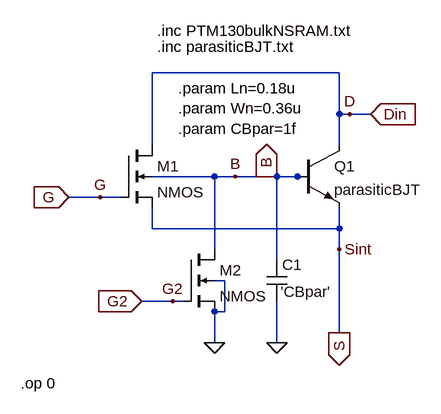
[diagram p0: schematic 2tnsram_simple.asc]
2tnsram_simple.asc, the LTspice schematic file:
Version 4
SHEET 1 3052 680
WIRE 800 0 512 0
WIRE 800 64 800 0
WIRE 816 64 800 64
WIRE 848 64 816 64
WIRE 512 112 512 0
WIRE 800 112 800 64
WIRE 608 160 512 160
WIRE 640 160 608 160
WIRE 688 160 640 160
WIRE 704 160 688 160
WIRE 736 160 704 160
WIRE 752 160 736 160
WIRE 432 192 384 192
WIRE 464 192 432 192
WIRE 512 240 512 208
WIRE 800 240 800 208
WIRE 800 240 512 240
WIRE 608 272 608 160
WIRE 800 272 800 240
WIRE 704 288 704 160
WIRE 624 320 608 320
WIRE 544 352 496 352
WIRE 560 352 544 352
WIRE 624 368 624 320
WIRE 624 368 608 368
WIRE 800 400 800 272
WIRE 608 416 608 368
WIRE 704 416 704 352
FLAG 640 160 B
FLAG 800 272 Sint
FLAG 816 64 D
FLAG 704 416 0
FLAG 608 416 0
FLAG 432 192 G
FLAG 544 352 G2
FLAG 384 192 G
IOPIN 384 192 In
FLAG 496 352 G2
IOPIN 496 352 In
FLAG 848 64 Din
IOPIN 848 64 In
FLAG 800 400 S
IOPIN 800 400 Out
FLAG 688 160 B
IOPIN 688 160 Out
SYMBOL npn 736 112 R0
SYMATTR InstName Q1
SYMATTR Value parasiticBJT
SYMATTR Value2 area=1u
SYMBOL nmos4 464 112 R0
SYMATTR InstName M1
SYMATTR Value2 l='Ln' w='Wn' m=1
SYMBOL cap 688 288 R0
WINDOW 3 22 49 Left 2
SYMATTR Value 'CBpar'
SYMATTR InstName C1
SYMATTR SpiceLine Rser=1m
SYMBOL nmos4 560 272 R0
SYMATTR InstName M2
SYMATTR Value2 l='Ln*10' w='Wn' m=1
TEXT 552 24 Left 2 !.param Ln=0.18u\n.param Wn=0.36u\n.param CBpar=1f
TEXT 520 -64 Left 2 !.inc PTM130bulkNSRAM.txt
TEXT 520 -40 Left 2 !.inc parasiticBJT.txt
TEXT 310 478 Left 2 !.op 0

The netlist it stands for:
* 2tnsram_simple.asc
Q1 Din B S 0 parasiticBJT area=1u
M1 Din G S B NMOS l='Ln' w='Wn' m=1
C1 B 0 'CBpar' Rser=1m
M2 B G2 0 0 NMOS l='Ln*10' w='Wn' m=1
.model NPN NPN
.model PNP PNP
.lib standard.bjt
.model NMOS NMOS
.model PMOS PMOS
.lib standard.mos
.param Ln=0.18u
.param Wn=0.36u
.param CBpar=1f
.inc PTM130bulkNSRAM.txt
.inc parasiticBJT.txt
.op 0
.backanno
.end